# Altium project MiniCNC_ver2.PrjPcb
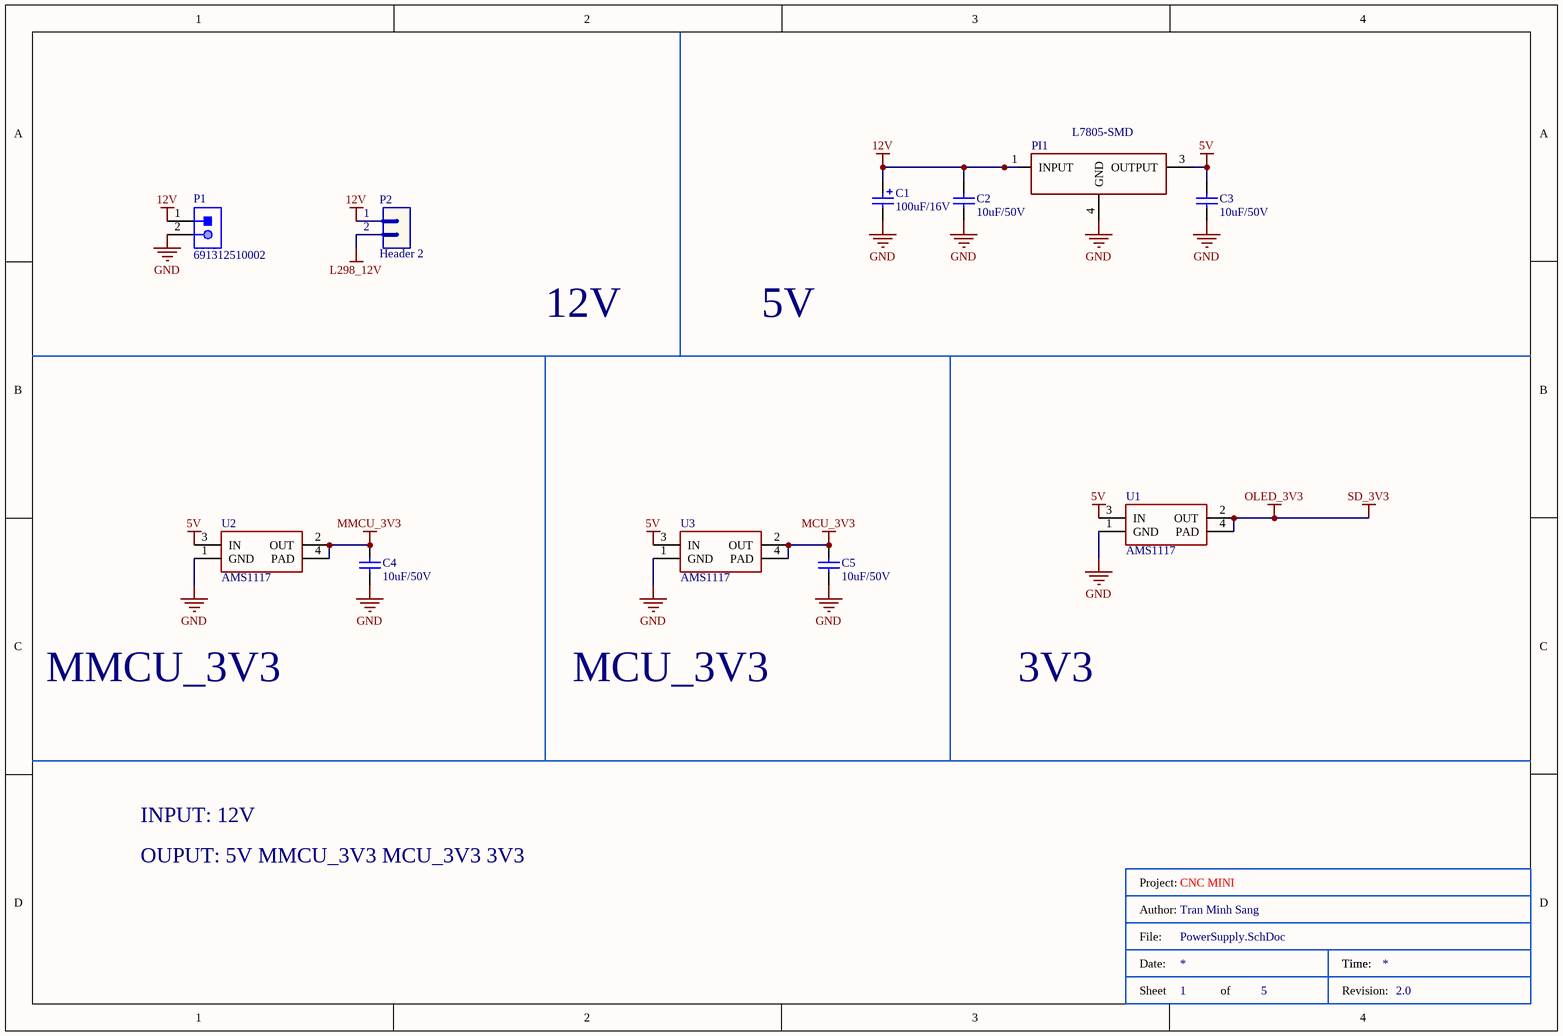
[diagram p0: PowerSupply.SchDoc]
MyAuthor: Tran Minh Sang; MyRevision: 2.0; Project: CNC MINI
5 sheets, 121 parts. Net scope: flat (ports and power ports of the same name join across sheets).
Board file: MiniCNC_ver2.PcbDoc
Sheets:
  PowerSupply.SchDoc
  MCU_Main.SchDoc
  MCU_Control.SchDoc
  Control_Display_SD.SchDoc
  Motor.SchDoc

## Sheet PowerSupply.SchDoc
size A4; SheetNumber: 1; SheetTotal: 5

### Parts
(Parts that share a designator on the sheet are numbered #1, #2 ... from top to bottom, then left to right.)
*#1  Title Block  (value not drawn)  (graphical)
C1  value 100uF/16V  [CAP-SM-AL-SIZE-D-D6L6]  (hidden comment: Cap-Al-100uF-16V-D6L5)
C2  value 10uF/50V  [CAP-SM-0805]  (hidden comment: Cap-10uF-50V-0805)
C3  value 10uF/50V  [CAP-SM-0805]  (hidden comment: Cap-10uF-50V-0805)
C4  value 10uF/50V  [CAP-SM-0805]  (hidden comment: Cap-10uF-50V-0805)
C5  value 10uF/50V  [CAP-SM-0805]  (hidden comment: Cap-10uF-50V-0805)
P1  691312510002  [691312510002]
P2  Header 2  [JP2]
PI1  L7805-SMD  [TO254P1435X464-4N]
U1  AMS1117  [SOT223]
U2  AMS1117  [SOT223]
U3  AMS1117  [SOT223]

### Nets
5V: C3.2 PI1.3(OUTPUT) U1.3(IN) U2.3(IN) U3.3(IN)
12V: C1.1 C2.2 P1.1 P2.1 PI1.1(INPUT)
GND: C1.2 C2.1 C3.1 C4.2 C5.2 P1.2 PI1.4(GND) U1.1(GND) U2.1(GND) U3.1(GND)
L298_12V: P2.2
MCU_3V3: C5.1 U3.2(OUT) U3.4(PAD)
MMCU_3V3: C4.1 U2.2(OUT) U2.4(PAD)
OLED_3V3: U1.2(OUT) U1.4(PAD)  [also labelled SD_3V3]  [project net VDD]

### Notes on the sheet
- 12V
- 5V
- MMCU_3V3
- MCU_3V3
- 3V3
- INPUT: 12V
- OUPUT: 5V MMCU_3V3 MCU_3V3 3V3
- (in symbol Title Block) Project:; Author:; File:; Date:; Time:; Sheet; of; Revision:

### Library data of the parts
C1 = Cap-Al-100uF-16V-D6L5: CAP ALUM 100UF 20% 16V SMD; Manufacturer: Nichicon; Manufacturer Part Number: UWX1C101MCL1GB; Local Supplier: thegioiic; Local Supplier Link: https://www.thegioiic.com/products/tu-nhom-smd-100uf-16v-6-3x5-4mm; Supplier 1: Digikey; Supplier 1 Part Number: 493-2105-1-ND; Supplier 1 Link: https://www.digikey.com/product-detail/en/nichicon/UWX1C101MCL1GB/493-2105-1-ND/590080
C2-C5 = Cap-10uF-50V-0805: CAP CER 10UF 50V X5R 0805; Manufacturer: Yageo; Manufacturer Part Number: CC0805KKX5R9BB106; Local Supplier: thegioiic; Local Supplier Link: https://www.thegioiic.com/products/tu-gom-0805-10uf-50v; Supplier 1: Digikey; Supplier 1 Link: https://www.digikey.com/product-detail/en/yageo/CC0805KKX5R9BB106/311-3499-2-ND/7164383; Supplier 1 Part Number: 311-3499-2-ND
P1 = 691312510002: WR-TBL Serie 312 Open Horizontal PCB Header, Pluggable, pitch 5.08mm, 2p; Compliance: RoHS; Modularity: No; Pin Number: 2; Rated Current [UL]: 20A; Working Voltage [UL]: 300VAC; ComponentLink1Description: Manufacturer; ComponentLink1URL: http://www.we-online.de; ComponentLink2URL: https://katalog.we-online.de/em/datasheet/691312510002.pdf; ComponentLink2Description: Datasheet; Mounting Technology: THT; Part Number: 691312510002; Packaging: Box; Operating Temperature: -40 to +105degC; PCB/Cable/Panel: PCB; Pitch: 5.08mm; Published Date: October 2019; Type: Horizontal; Publisher: Wurth Elektronik; Application: Pluggable
P2 = Header 2: Header, 2-Pin; LatestRevisionDate: 17-Jul-2002; LatestRevisionNote: Re-released for DXP Platform.; Publisher: Altium Limited; Local Supplier: thegioiic; Local Supplier Part Number: x; Local Supplier Link: https://www.thegioiic.com/products/hang-rao-duc-don-2-54mm-40-chan-1-hang-cao-11-4mm-xuyen-lo
U1-U3 = AMS1117: Available in 1.8V, 2.5V, 2.85V, 3.3V, 5V, and  Adjustable Versions; Local Supplier: thegioiic; Local Supplier Part Number: *; Local Supplier Link: https://www.thegioiic.com/products/ams1117-3-3v
PI1 = L7805-SMD: Local Supplier: thegioiic; Local Supplier Part Number: *; Local Supplier Link: https://www.thegioiic.com/products/l7805acd2t

## Sheet MCU_Main.SchDoc
size A4; SheetNumber: 2; SheetTotal: 5
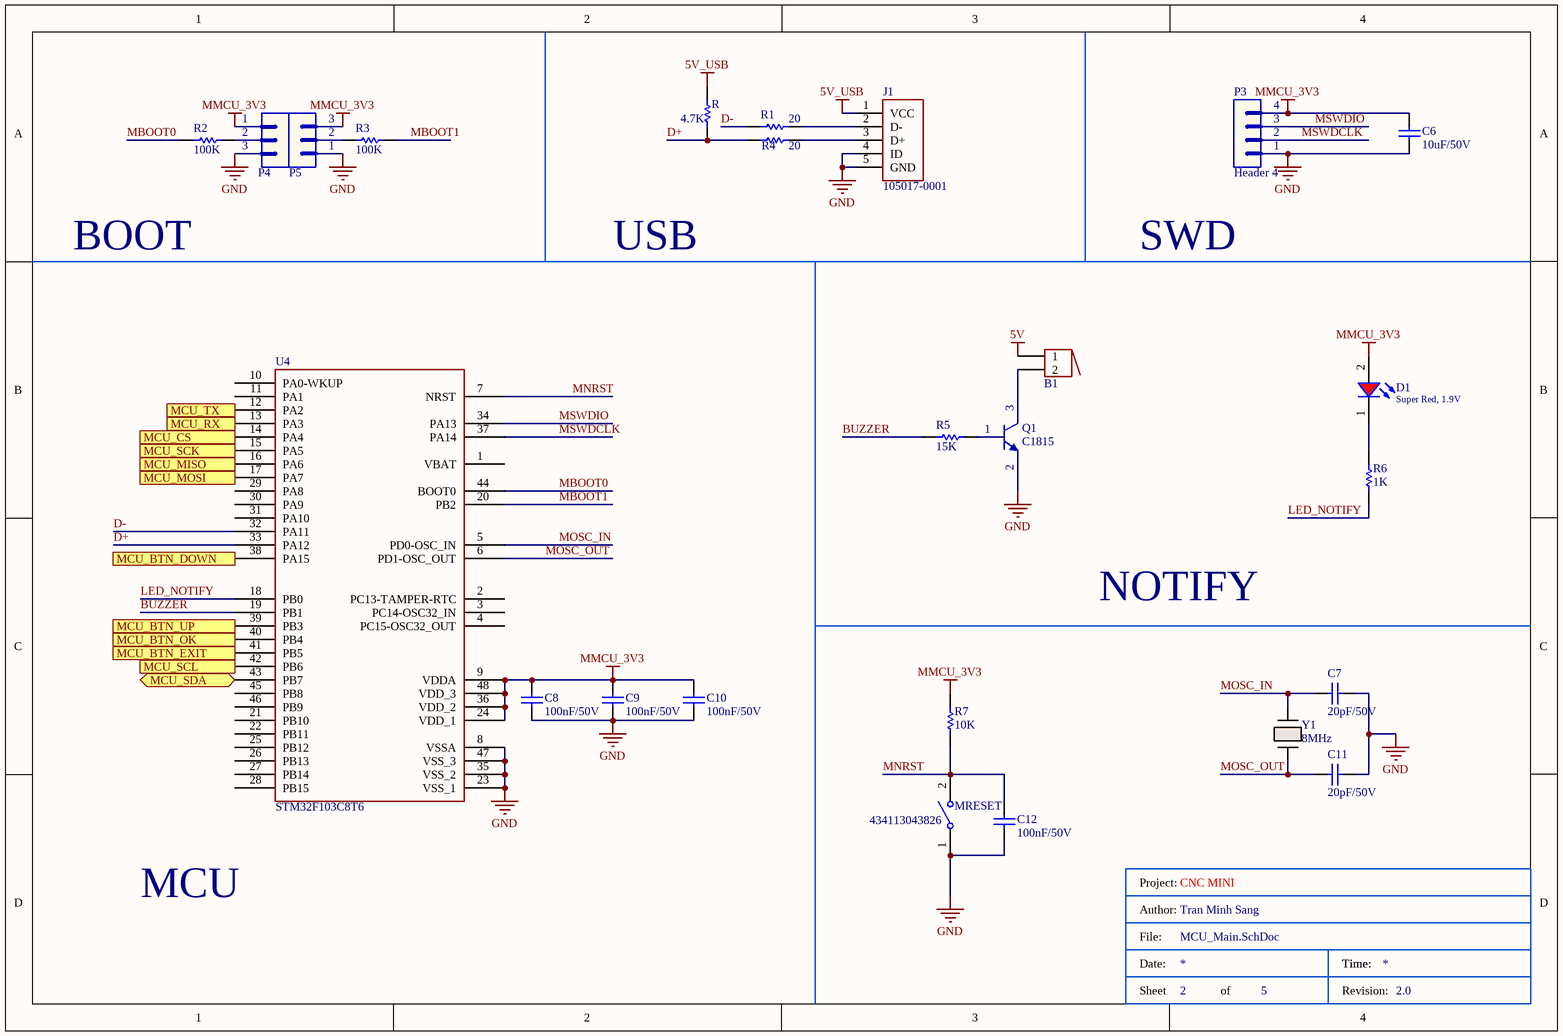
[diagram p1: MCU_Main.SchDoc]

### Parts
(Parts that share a designator on the sheet are numbered #1, #2 ... from top to bottom, then left to right.)
*#2  Title Block  (value not drawn)  (graphical)
B1  Buzzer  [BUZZER]  (value not drawn)
C6  value 10uF/50V  [CAP-SM-0805]  (hidden comment: Cap-10uF-50V-0805)
C7  value 20pF/50V  [CAP-SM-0805]  (hidden comment: Cap-22pF-50V-0805)
C8  value 100nF/50V  [CAP-SM-0805]  (hidden comment: Cap-100nF-50V-0805)
C9  value 100nF/50V  [CAP-SM-0805]  (hidden comment: Cap-100nF-50V-0805)
C10  value 100nF/50V  [CAP-SM-0805]  (hidden comment: Cap-100nF-50V-0805)
C11  value 20pF/50V  [CAP-SM-0805]  (hidden comment: Cap-22pF-50V-0805)
C12  value 100nF/50V  [CAP-SM-0805]  (hidden comment: Cap-100nF-50V-0805)
D1  Super Red, 1.9V  [WL-SMCW_0805]
J1  105017-0001  [Micro-USB-Female]
MRESET  434113043826  [434113043826]
P3  Header 4  [JP4]
P4  Header 3  [JP3]  (value not drawn)
P5  Header 3  [JP3]  (value not drawn)
Q1  C1815  [SOT23_NEX]
R  value 4.7K  [RES-SM-0805]  (hidden comment: Res-4.7K-0805)
R1  value 20  [RES-SM-0805]  (hidden comment: Res-270-0805)
R2  value 100K  [RES-SM-0805]  (hidden comment: Res-100K-0805)
R3  value 100K  [RES-SM-0805]  (hidden comment: Res-100K-0805)
R4  value 20  [RES-SM-0805]  (hidden comment: Res-270-0805)
R5  value 15K  [RES-SM-0805]  (hidden comment: Res-15K-0805)
R6  value 1K  [RES-SM-0805]  (hidden comment: Res-1K-0805)
R7  value 10K  [RES-SM-0805]  (hidden comment: Res-10k-0805)
U4  STM32F103C8T6  [LQFP-48]
Y1  8MHz  [xtal2_CX5032GB_AVX-L]

### Ports
MCU_BTN_DOWN (out), MCU_BTN_EXIT (out), MCU_BTN_OK (out), MCU_BTN_UP (out), MCU_CS (out), MCU_MISO (in), MCU_MOSI (out), MCU_RX (in), MCU_SCK (out), MCU_SCL (out), MCU_SDA (bidir), MCU_TX (out)

### Nets
5V: B1.1
5V_USB: J1.1(VCC) R.1
GND: C6.1 C7.1 C8.2 C9.2 C10.2 C11.1 C12.1 J1.4(ID) J1.5(GND) MRESET.1 P3.1 P4.3 P5.1 Q1.2(E) U4.8(VSSA) U4.23(VSS_1) U4.35(VSS_2) U4.47(VSS_3)
MMCU_3V3: C6.2 C8.1 C9.1 C10.1 D1.2(A) P3.4 P4.1 P5.3 R7.2 U4.9(VDDA) U4.24(VDD_1) U4.36(VDD_2) U4.48(VDD_3)
BUZZER: R5.1 U4.19(PB1)
CMD: U4.17(PA7) ; port MCU_MOSI
CS: U4.14(PA4) ; port MCU_CS
D+: R.2 R4.2 U4.33(PA12)
D-: R1.2 U4.32(PA11)
DAT0: U4.16(PA6) ; port MCU_MISO
LED_NOTIFY: R6.1 U4.18(PB0)
MBOOT0: R2.1 U4.44(BOOT0)
MBOOT1: R3.2 U4.20(PB2)
MNRST: C12.2 MRESET.2 R7.1 U4.7(NRST)
MOSC_IN: C7.2 U4.5(PD0-OSC_IN) Y1.1
MOSC_OUT: C11.2 U4.6(PD1-OSC_OUT) Y1.2
MSWDCLK: P3.2 U4.37(PA14)
MSWDIO: P3.3 U4.34(PA13)
NetB1_2: B1.2 Q1.3(C)
NetC25_2: U4.39(PB3) ; port MCU_BTN_UP
NetC26_2: U4.38(PA15) ; port MCU_BTN_DOWN
NetC27_2: U4.40(PB4) ; port MCU_BTN_OK
NetC28_2: U4.41(PB5) ; port MCU_BTN_EXIT
NetD1_1: D1.1(K) R6.2
NetJ1_2: J1.2(D-) R1.1
NetJ1_3: J1.3(D+) R4.1
NetP4_2: P4.2 R2.2
NetP5_2: P5.2 R3.1
NetQ1_1: Q1.1(B) R5.2
NetU4_12: U4.12(PA2) ; port MCU_TX
NetU4_13: U4.13(PA3) ; port MCU_RX
NetU4_15: U4.15(PA5) ; port MCU_SCK
NetU4_42: U4.42(PB6) ; port MCU_SCL
NetU4_43: U4.43(PB7) ; port MCU_SDA

Not connected (* = marked no-connect by the designer): U4 1(VBAT) 2(PC13-TAMPER-RTC) 3(PC14-OSC32_IN) 4(PC15-OSC32_OUT) 10(PA0-WKUP) 11(PA1) 21(PB10) 22(PB11) 25(PB12) 26(PB13) 27(PB14) 28(PB15) 29(PA8) 30(PA9) 31(PA10) 45(PB8) 46(PB9)

### Notes on the sheet
- BOOT
- USB
- SWD
- NOTIFY
- MCU
- (in symbol Title Block) Project:; Author:; File:; Date:; Time:; Sheet; of; Revision:

### Library data of the parts
C6 = Cap-10uF-50V-0805: as C2 on sheet PowerSupply; Local Supplier: thegioiic; Local Supplier Link: https://www.thegioiic.com/products/tu-gom-0805-10uf-50v; Supplier 1: Digikey; Supplier 1 Link: https://www.digikey.com/product-detail/en/yageo/CC0805KKX5R9BB106/311-3499-2-ND/7164383; Supplier 1 Part Number: 311-3499-2-ND
C7 C11 = Cap-22pF-50V-0805: CAP CER 22PF 100V X7R 0805; Manufacturer: Johanson Dielectrics Inc.; Manufacturer Part Number: 101X15W102MV4E; Local Supplier: thegioiic; Local Supplier Link: https://thegioiic.com/products/tu-1nf-50v-0805; Supplier 1: Digikey; Supplier 1 Link: https://www.digikey.com/product-detail/en/johanson-dielectrics-inc/101X15W102MV4E/709-1335-1-ND/2327235; Supplier 1 Part Number: 709-1335-1-ND
C8-C10 C12 = Cap-100nF-50V-0805: CAP CER 0.1UF 50V Y5V 0805; Manufacturer: Samsung Electro-Mechanics; Manufacturer Part Number: CL21F104ZBCNNNC; Local Supplier: thegioiic; Local Supplier Link: https://www.thegioiic.com/products/tu-gom-0805-100nf-0-1uf-50v; Supplier 1: Digikey; Supplier 1 Part Number: 1276-1007-1-ND; Supplier 1 Link: https://www.digikey.com/product-detail/en/samsung-electro-mechanics/CL21F104ZBCNNNC/1276-1007-1-ND/3889093
D1 = 150080SS75000: WL-SMCW SMT Mono-color Chip LED Waterclear, size 0805, Super Red, 1.9V, 140deg; Chip Technology: AlInGaP; Dominant Wavelength typ.: 630nm; Luminous Intensity typ.: 60mcd; Peak Wavelength typ.: 645nm; Viewing Angle: 140deg; ComponentLink1Description: Manufacturer; ComponentLink1URL: http://www.we-online.de; ComponentLink2URL: https://www.we-online.com/catalog/datasheet/150080SS75000.pdf; ComponentLink2Description: Datasheet; Forward Voltage typ.: 1.9V; Emitting Color: Super Red; Mounting Technology: SMT; Operating Temperature: -40 to +85degC; Published Date: December 2019; Part Number: 150080SS75000; Packaging: Tape and Reel; Size: 0805; Publisher: Wurth Elektronik
J1 = Micro-USB-Female: CONN RCPT USB2.0 MICRO B SMD R/A; Vendor: Molex Connector Corporation; Built_By: EMA_Cory; SourceLibrary: Molex_2020-05-26; Datasheet: https://www.molex.com/pdm_docs/sd/1050170001_sd.pdf; Manufacturer_Part_Number: 105017-0001; Copyright: Copyright (C) 2018 Accelerated Designs. All rights reserved; RefDes: RefDes; Type: DEV; Local Supplier: thegioiic; Local Supplier Part Number: x; Local Supplier Link: https://www.thegioiic.com/products/cong-usb-micro-b-2-0-dau-cai-5-chan-smd-v1
MRESET = 434113043826: WS-TASV J-Bend SMT Tact Switch 6x3.5mm, height 4.3mm, 260gf; Rated Voltage: 12VDC; Rated Current: 50mA; Washable: No; ComponentLink1Description: Manufacturer; ComponentLink1URL: http://www.we-online.de; ComponentLink2Description: Datasheet; ComponentLink2URL: https://katalog.we-online.com/em/datasheet/434113043826.pdf; Operating Temperature: -40 to +85degC; Part Number: 434113043826; Published Date: September 2019; Contact Material: Stainless Steel; Height: 4.3mm; Mounting Technology: SMT; Contact Plating: Silver; Operation Force: 260gf; Packaging: Tape and Reel; Terminal Material: Copper Alloy; Publisher: Wurth Elektronik; Terminal Plating: Silver; Local Supplier: thegioiic; Local Supplier Link: https://www.thegioiic.com/products/nut-nhan-3-5x6mm-cao-5mm-2-chan-smd-dau-trang; Local Supplier Part Number: x
P3 = Header 4: Header, 4-Pin; LatestRevisionDate: 17-Jul-2002; LatestRevisionNote: Re-released for DXP Platform.; Publisher: Altium Limited; Local Supplier: thegioiic; Local Supplier Part Number: x; Local Supplier Link: https://www.thegioiic.com/products/hang-rao-duc-don-2-54mm-40-chan-1-hang-cao-11-4mm-xuyen-lo
P4 P5 = Header 3: Header, 3-Pin; LatestRevisionDate: 17-Jul-2002; LatestRevisionNote: Re-released for DXP Platform.; Publisher: Altium Limited; Local Supplier: thegioiic; Local Supplier Part Number: x; Local Supplier Link: https://www.thegioiic.com/products/hang-rao-duc-don-2-54mm-40-chan-1-hang-cao-11-4mm-xuyen-lo
R = Res-4.7K-0805: RES SMD 4.7K OHM 5% 1/8W 0805; Manufacturer: Yageo; Manufacturer Part Number: RC0805JR-074K7L; Local Supplier: thegioiic; Local Supplier Link: https://www.thegioiic.com/products/dien-tro-4-7-kohm-0805-5; Supplier 1: Digikey; Supplier 1 Link: https://www.digikey.com/product-detail/en/yageo/RC0805JR-074K7L/311-4.7KARCT-ND/731274; Supplier 1 Part Number: 311-4.7KARCT-ND
R1 R4 = Res-270-0805: RES SMD 270 OHM 0.1% 0.15W 0705; Manufacturer: Vishay Dale; Manufacturer Part Number: M55342E06B270ART5; Local Supplier: thegioiic; Local Supplier Link: https://thegioiic.com/products/dien-tro-270-ohm-0805-5; Supplier 1: Digikey; Supplier 1 Link: https://www.digikey.com/product-detail/en/vishay-dale/M55342E06B270ART5/1135-1723-6-ND/3197905; Supplier 1 Part Number: 1135-1723-6-ND
R2 R3 = Res-100K-0805: RES 0 OHM JUMPER 0805; Manufacturer: Vishay Dale; Manufacturer Part Number: WSL080500000ZEA9; Local Supplier: thegioiic; Local Supplier Link: https://www.thegioiic.com/products/dien-tro-100-kohm-0805-5; Supplier 1: Digikey; Supplier 1 Link: https://www.digikey.com/product-detail/en/vishay-dale/WSL080500000ZEA9/541-3928-1-ND/7423223; Supplier 1 Part Number: 541-3928-1-ND
R5 = Res-15K-0805: RES 15K OHM 1% 1/4W 0805; Manufacturer: TE Connectivity Passive Product; Manufacturer Part Number: CRGCQ0805F15K; Local Supplier: thegioiic; Local Supplier Link: https://www.thegioiic.com/products/dien-tro-15-kohm-0805-5; Supplier 1: Digikey; Supplier 1 Part Number: A129763CT-ND; Supplier 1 Link: https://www.digikey.com/product-detail/en/te-connectivity-passive-product/CRGCQ0805F15K/A129763CT-ND/8577595
R6 = Res-1K-0805: RES 1K OHM 1% 1/4W 0805; Manufacturer: Stackpole Electronics Inc; Manufacturer Part Number: RNCP0805FTD1K00; Local Supplier: thegioiic; Local Supplier Link: https://www.thegioiic.com/products/dien-tro-1-kohm-0805-5; Supplier 1: Digikey; Supplier 1 Link: https://www.digikey.com/product-detail/en/stackpole-electronics-inc/RNCP0805FTD1K00/RNCP0805FTD1K00CT-ND/2240568; Supplier 1 Part Number: RNCP0805FTD1K00CT-ND
R7 = Res-10k-0805: RES 10K OHM 1% 1/4W 0805; Manufacturer: Stackpole Electronics Inc; Manufacturer Part Number: RNCP0805FTD10K0; Local Supplier: thegioiic; Local Supplier Link: https://www.thegioiic.com/products/dien-tro-10-kohm-0805-5; Supplier 1: Digikey; Supplier 1 Link: https://www.digikey.com/product-detail/en/stackpole-electronics-inc/RNCP0805FTD10K0/RNCP0805FTD10K0CT-ND/2240601; Supplier 1 Part Number: RNCP0805FTD10K0CT-ND
U4 = STM32F103C8T6: Manufacturer: ST Electronic; Manufacture Part Number: STM32F103C8T6; Local Supplier: thegioiic; Local Supplier Part Number: STM32F103C8T6; Local Supplier Link: https://www.thegioiic.com/products/stm32f103c8t6
Y1 = XTAL: No Description Available; Mfr_Name: KYOCERA AVX; Manufacturer_Part_Number: CX5032GB08000H0HEQZ1; Copyright: Copyright (C) 2023 Ultra Librarian. All rights reserved.; RefDes: RefDes; Type: DEV
B1 = Buzzer: Local Supplier: thegioiic; Local Supplier Link: https://www.thegioiic.com/products/1209-dip-buzzer-12x9mm; Local Supplier Part Number: 1209 DIP Buzzer 12x9mm

## Sheet MCU_Control.SchDoc
size A4; SheetNumber: 3; SheetTotal: 5
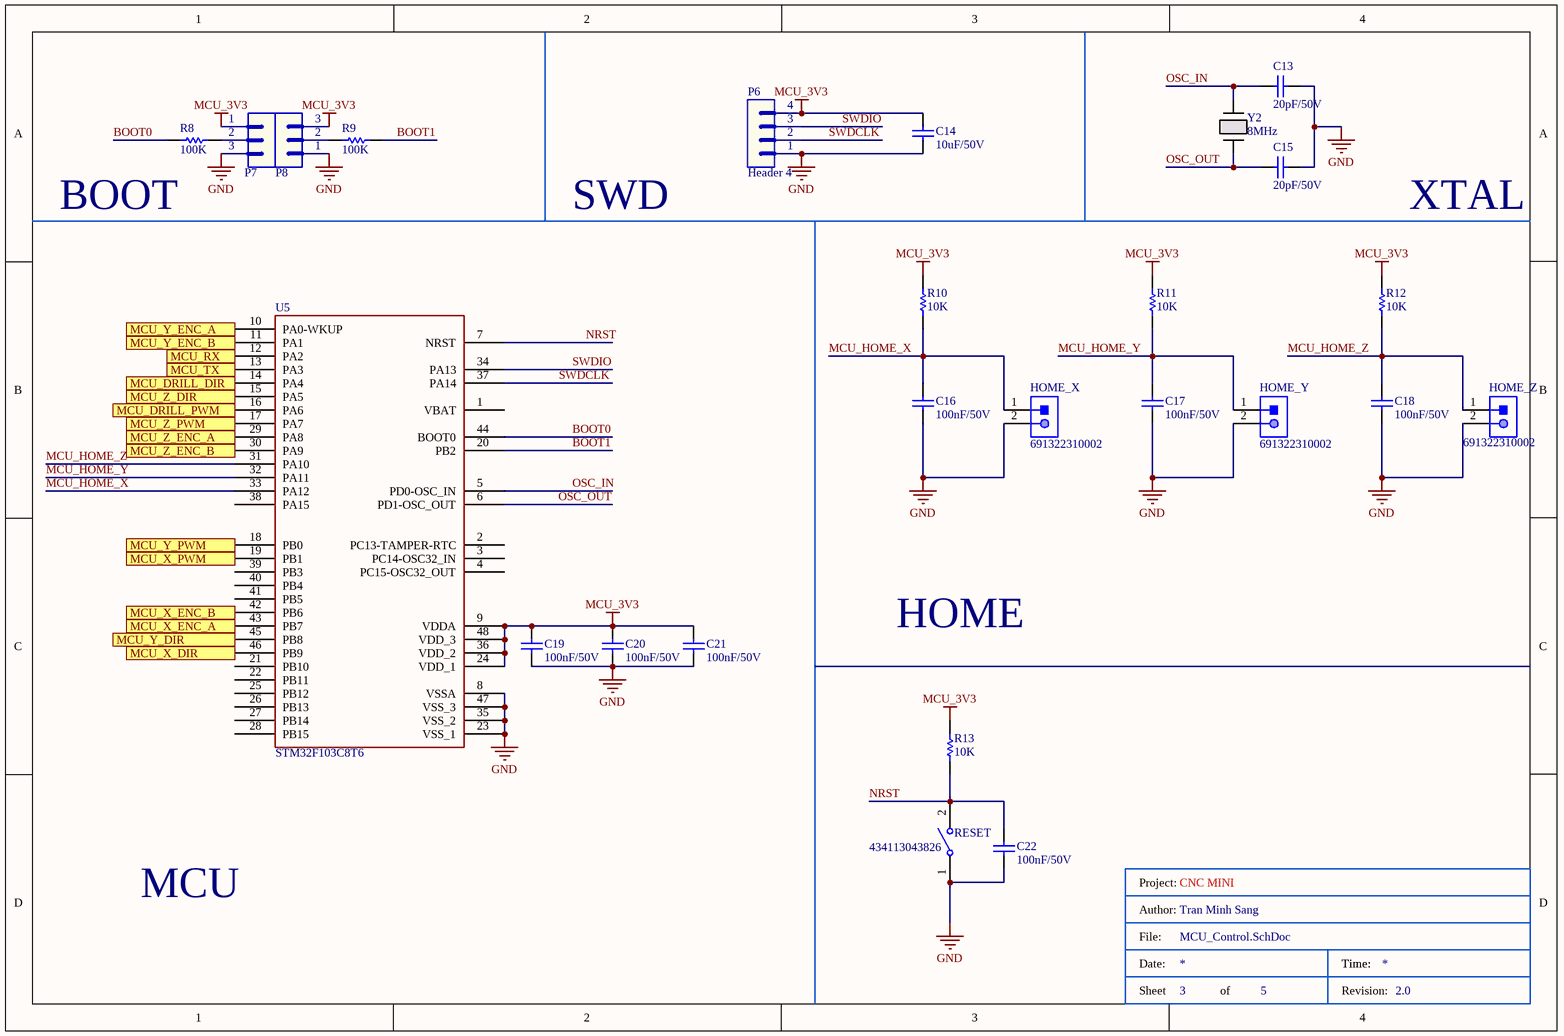
[diagram p2: MCU_Control.SchDoc]

### Parts
(Parts that share a designator on the sheet are numbered #1, #2 ... from top to bottom, then left to right.)
*#3  Title Block  (value not drawn)  (graphical)
C13  value 20pF/50V  [CAP-SM-0805]  (hidden comment: Cap-22pF-50V-0805)
C14  value 10uF/50V  [CAP-SM-0805]  (hidden comment: Cap-10uF-50V-0805)
C15  value 20pF/50V  [CAP-SM-0805]  (hidden comment: Cap-22pF-50V-0805)
C16  value 100nF/50V  [CAP-SM-0805]  (hidden comment: Cap-100nF-50V-0805)
C17  value 100nF/50V  [CAP-SM-0805]  (hidden comment: Cap-100nF-50V-0805)
C18  value 100nF/50V  [CAP-SM-0805]  (hidden comment: Cap-100nF-50V-0805)
C19  value 100nF/50V  [CAP-SM-0805]  (hidden comment: Cap-100nF-50V-0805)
C20  value 100nF/50V  [CAP-SM-0805]  (hidden comment: Cap-100nF-50V-0805)
C21  value 100nF/50V  [CAP-SM-0805]  (hidden comment: Cap-100nF-50V-0805)
C22  value 100nF/50V  [CAP-SM-0805]  (hidden comment: Cap-100nF-50V-0805)
HOME_X  691322310002  [691322310002]
HOME_Y  691322310002  [691322310002]
HOME_Z  691322310002  [691322310002]
P6  Header 4  [JP4]
P7  Header 3  [JP3]  (value not drawn)
P8  Header 3  [JP3]  (value not drawn)
R8  value 100K  [RES-SM-0805]  (hidden comment: Res-100K-0805)
R9  value 100K  [RES-SM-0805]  (hidden comment: Res-100K-0805)
R10  value 10K  [RES-SM-0805]  (hidden comment: Res-10k-0805)
R11  value 10K  [RES-SM-0805]  (hidden comment: Res-10k-0805)
R12  value 10K  [RES-SM-0805]  (hidden comment: Res-10k-0805)
R13  value 10K  [RES-SM-0805]  (hidden comment: Res-10k-0805)
RESET  434113043826  [434113043826]
U5  STM32F103C8T6  [LQFP-48]
Y2  8MHz  [xtal2_CX5032GB_AVX-L]

### Ports
MCU_DRILL_DIR (out), MCU_DRILL_PWM (out), MCU_RX (out), MCU_TX (in), MCU_X_DIR (out), MCU_X_ENC_A (in), MCU_X_ENC_B (in), MCU_X_PWM (out), MCU_Y_DIR (out), MCU_Y_ENC_A (in), MCU_Y_ENC_B (in), MCU_Y_PWM (out), MCU_Z_DIR (out), MCU_Z_ENC_A (in), MCU_Z_ENC_B (in), MCU_Z_PWM (out)

### Nets
GND: C13.1 C14.1 C15.1 C16.1 C17.1 C18.1 C19.2 C20.2 C21.2 C22.1 HOME_X.2 HOME_Y.2 HOME_Z.2 P6.1 P7.3 P8.1 RESET.1 U5.8(VSSA) U5.23(VSS_1) U5.35(VSS_2) U5.47(VSS_3)
MCU_3V3: C14.2 C19.1 C20.1 C21.1 P6.4 P7.1 P8.3 R10.2 R11.2 R12.2 R13.2 U5.9(VDDA) U5.24(VDD_1) U5.36(VDD_2) U5.48(VDD_3)
BOOT0: R8.1 U5.44(BOOT0)
BOOT1: R9.2 U5.20(PB2)
MCU_HOME_X: C16.2 HOME_X.1 R10.1 U5.33(PA12)
MCU_HOME_Y: C17.2 HOME_Y.1 R11.1 U5.32(PA11)
MCU_HOME_Z: C18.2 HOME_Z.1 R12.1 U5.31(PA10)
NRST: C22.2 R13.1 RESET.2 U5.7(NRST)
OSC_IN: C13.2 U5.5(PD0-OSC_IN) Y2.1
OSC_OUT: C15.2 U5.6(PD1-OSC_OUT) Y2.2
SWDCLK: P6.2 U5.37(PA14)
SWDIO: P6.3 U5.34(PA13)
NetP7_2: P7.2 R8.2
NetP8_2: P8.2 R9.1
NetU4_12: U5.13(PA3) ; port MCU_TX
NetU4_13: U5.12(PA2) ; port MCU_RX
NetU5_10: U5.10(PA0-WKUP) ; port MCU_Y_ENC_A
NetU5_11: U5.11(PA1) ; port MCU_Y_ENC_B
NetU5_14: U5.14(PA4) ; port MCU_DRILL_DIR
NetU5_15: U5.15(PA5) ; port MCU_Z_DIR
NetU5_16: U5.16(PA6) ; port MCU_DRILL_PWM
NetU5_17: U5.17(PA7) ; port MCU_Z_PWM
NetU5_18: U5.18(PB0) ; port MCU_Y_PWM
NetU5_19: U5.19(PB1) ; port MCU_X_PWM
NetU5_29: U5.29(PA8) ; port MCU_Z_ENC_A
NetU5_30: U5.30(PA9) ; port MCU_Z_ENC_B
NetU5_42: U5.42(PB6) ; port MCU_X_ENC_B
NetU5_43: U5.43(PB7) ; port MCU_X_ENC_A
NetU5_45: U5.45(PB8) ; port MCU_Y_DIR
NetU5_46: U5.46(PB9) ; port MCU_X_DIR

Not connected (* = marked no-connect by the designer): U5 1(VBAT) 2(PC13-TAMPER-RTC) 3(PC14-OSC32_IN) 4(PC15-OSC32_OUT) 21(PB10) 22(PB11) 25(PB12) 26(PB13) 27(PB14) 28(PB15) 38(PA15) 39(PB3) 40(PB4) 41(PB5)

### Notes on the sheet
- (near R8) BOOT
- SWD
- XTAL
- HOME
- MCU
- (in symbol Title Block) Project:; Author:; File:; Date:; Time:; Sheet; of; Revision:

### Library data of the parts
C13 C15 = Cap-22pF-50V-0805: as C7 on sheet MCU_Main; Local Supplier: thegioiic; Local Supplier Link: https://thegioiic.com/products/tu-1nf-50v-0805; Supplier 1: Digikey; Supplier 1 Link: https://www.digikey.com/product-detail/en/johanson-dielectrics-inc/101X15W102MV4E/709-1335-1-ND/2327235; Supplier 1 Part Number: 709-1335-1-ND
C14 = Cap-10uF-50V-0805: as C2 on sheet PowerSupply; Local Supplier: thegioiic; Local Supplier Link: https://www.thegioiic.com/products/tu-gom-0805-10uf-50v; Supplier 1: Digikey; Supplier 1 Link: https://www.digikey.com/product-detail/en/yageo/CC0805KKX5R9BB106/311-3499-2-ND/7164383; Supplier 1 Part Number: 311-3499-2-ND
C16-C22 = Cap-100nF-50V-0805: as C8 on sheet MCU_Main; Local Supplier: thegioiic; Local Supplier Link: https://www.thegioiic.com/products/tu-gom-0805-100nf-0-1uf-50v; Supplier 1: Digikey; Supplier 1 Part Number: 1276-1007-1-ND; Supplier 1 Link: https://www.digikey.com/product-detail/en/samsung-electro-mechanics/CL21F104ZBCNNNC/1276-1007-1-ND/3889093
HOME_X HOME_Y HOME_Z = 691322310002: WR-TBL Serie 322 Horizontal PCB Header, Pluggable, pitch 3.81mm, 2p; Compliance: RoHS; Modularity: No; Pin Number: 2; Rated Current [UL]: 10A; Working Voltage [UL]: 300VAC; ComponentLink1Description: Manufacturer; ComponentLink1URL: http://www.we-online.de; ComponentLink2URL: https://katalog.we-online.de/em/datasheet/691322310002.pdf; ComponentLink2Description: Datasheet; Mounting Technology: THT; Part Number: 691322310002; Packaging: Box; Operating Temperature: -40 to +105degC; PCB/Cable/Panel: PCB; Pitch: 3.81mm; Published Date: October 2019; Type: Horizontal; Publisher: Wurth Elektronik; Application: Pluggable
P6 = Header 4: Header, 4-Pin; LatestRevisionDate: 17-Jul-2002; LatestRevisionNote: Re-released for DXP Platform.; Publisher: Altium Limited; Local Supplier: thegioiic; Local Supplier Part Number: x; Local Supplier Link: https://www.thegioiic.com/products/hang-rao-duc-don-2-54mm-40-chan-1-hang-cao-11-4mm-xuyen-lo
P7 P8 = Header 3: Header, 3-Pin; LatestRevisionDate: 17-Jul-2002; LatestRevisionNote: Re-released for DXP Platform.; Publisher: Altium Limited; Local Supplier: thegioiic; Local Supplier Part Number: x; Local Supplier Link: https://www.thegioiic.com/products/hang-rao-duc-don-2-54mm-40-chan-1-hang-cao-11-4mm-xuyen-lo
R8 R9 = Res-100K-0805: as R2 on sheet MCU_Main; Local Supplier: thegioiic; Local Supplier Link: https://www.thegioiic.com/products/dien-tro-100-kohm-0805-5; Supplier 1: Digikey; Supplier 1 Link: https://www.digikey.com/product-detail/en/vishay-dale/WSL080500000ZEA9/541-3928-1-ND/7423223; Supplier 1 Part Number: 541-3928-1-ND
R10-R13 = Res-10k-0805: as R7 on sheet MCU_Main; Local Supplier: thegioiic; Local Supplier Link: https://www.thegioiic.com/products/dien-tro-10-kohm-0805-5; Supplier 1: Digikey; Supplier 1 Link: https://www.digikey.com/product-detail/en/stackpole-electronics-inc/RNCP0805FTD10K0/RNCP0805FTD10K0CT-ND/2240601; Supplier 1 Part Number: RNCP0805FTD10K0CT-ND
RESET = 434113043826: as MRESET on sheet MCU_Main; ComponentLink1Description: Manufacturer; ComponentLink1URL: http://www.we-online.de; ComponentLink2Description: Datasheet; ComponentLink2URL: https://katalog.we-online.com/em/datasheet/434113043826.pdf; Operating Temperature: -40 to +85degC; Part Number: 434113043826; Published Date: September 2019; Contact Material: Stainless Steel; Height: 4.3mm; Mounting Technology: SMT; Contact Plating: Silver; Operation Force: 260gf; Packaging: Tape and Reel; Terminal Material: Copper Alloy; Publisher: Wurth Elektronik; Terminal Plating: Silver; Local Supplier: thegioiic; Local Supplier Link: https://www.thegioiic.com/products/nut-nhan-3-5x6mm-cao-5mm-2-chan-smd-dau-trang; Local Supplier Part Number: x
U5 = STM32F103C8T6: Manufacturer: ST Electronic; Manufacture Part Number: STM32F103C8T6; Local Supplier: thegioiic; Local Supplier Part Number: STM32F103C8T6; Local Supplier Link: https://www.thegioiic.com/products/stm32f103c8t6
Y2 = XTAL: as Y1 on sheet MCU_Main; Copyright: Copyright (C) 2023 Ultra Librarian. All rights reserved.; RefDes: RefDes; Type: DEV

## Sheet Control_Display_SD.SchDoc
size A4; SheetNumber: 4; SheetTotal: 5
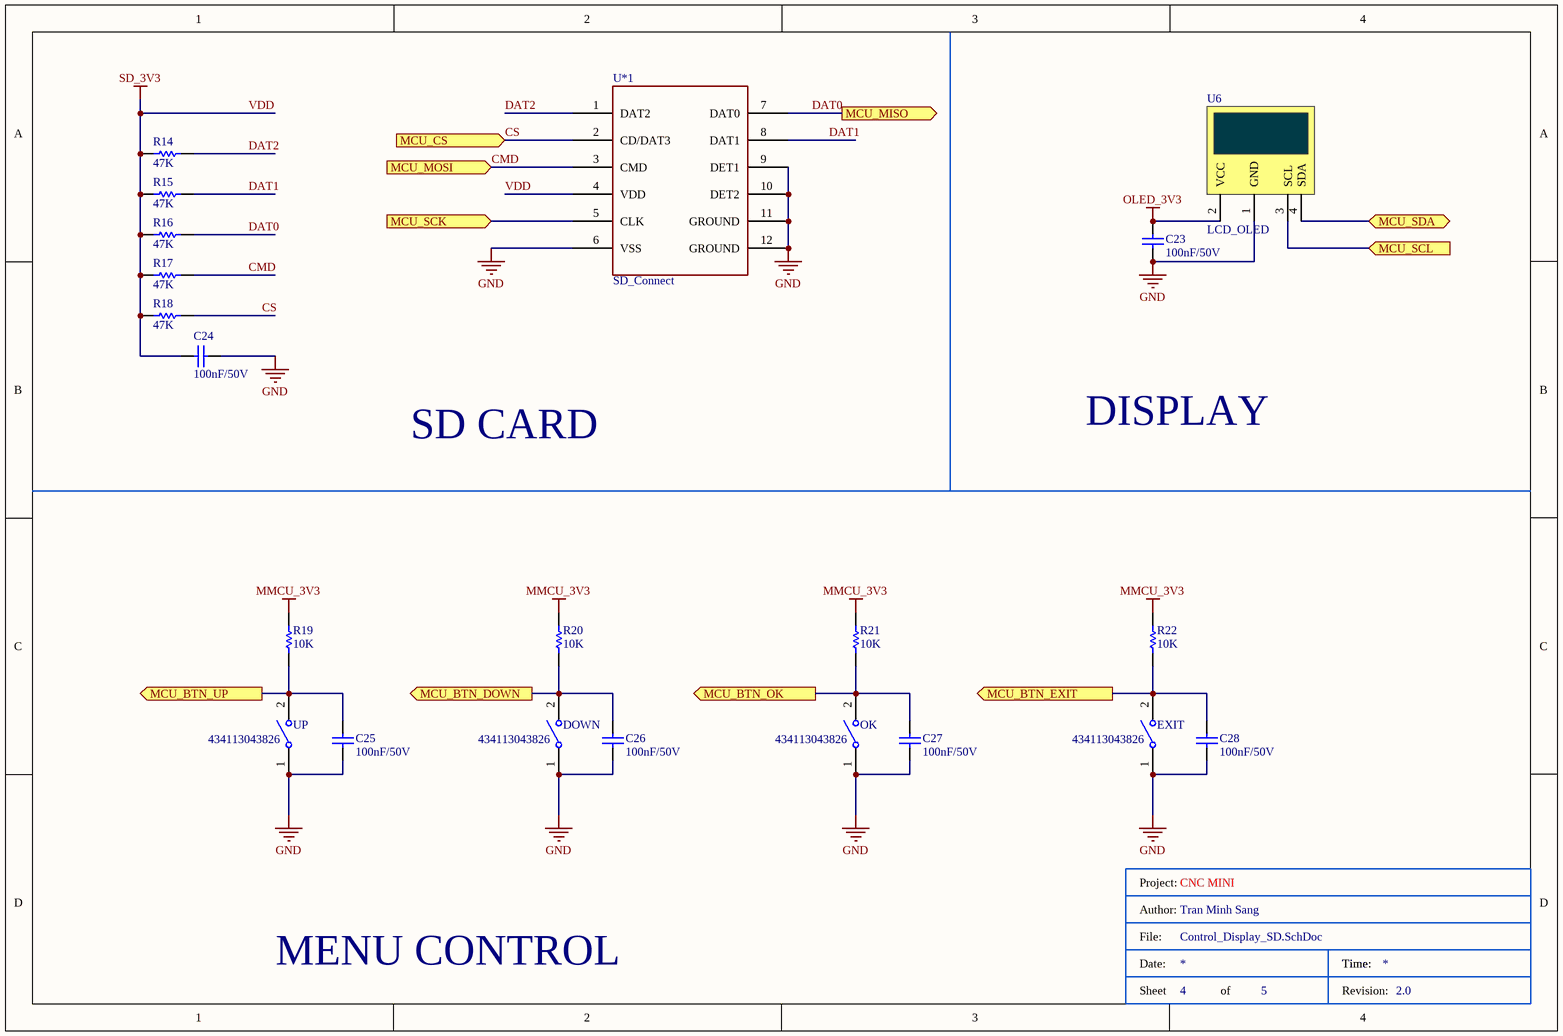
[diagram p3: Control_Display_SD.SchDoc]

### Parts
(Parts that share a designator on the sheet are numbered #1, #2 ... from top to bottom, then left to right.)
*#4  Title Block  (value not drawn)  (graphical)
C23  value 100nF/50V  [CAP-SM-0805]  (hidden comment: Cap-100nF-50V-0805)
C24  value 100nF/50V  [CAP-SM-0805]  (hidden comment: Cap-100nF-50V-0805)
C25  value 100nF/50V  [CAP-SM-0805]  (hidden comment: Cap-100nF-50V-0805)
C26  value 100nF/50V  [CAP-SM-0805]  (hidden comment: Cap-100nF-50V-0805)
C27  value 100nF/50V  [CAP-SM-0805]  (hidden comment: Cap-100nF-50V-0805)
C28  value 100nF/50V  [CAP-SM-0805]  (hidden comment: Cap-100nF-50V-0805)
DOWN  434113043826  [434113043826]
EXIT  434113043826  [434113043826]
OK  434113043826  [434113043826]
R14  value 47K  [RES-SM-0805]  (hidden comment: Res-47K-0805)
R15  value 47K  [RES-SM-0805]  (hidden comment: Res-47K-0805)
R16  value 47K  [RES-SM-0805]  (hidden comment: Res-47K-0805)
R17  value 47K  [RES-SM-0805]  (hidden comment: Res-47K-0805)
R18  value 47K  [RES-SM-0805]  (hidden comment: Res-47K-0805)
R19  value 10K  [RES-SM-0805]  (hidden comment: Res-10k-0805)
R20  value 10K  [RES-SM-0805]  (hidden comment: Res-10k-0805)
R21  value 10K  [RES-SM-0805]  (hidden comment: Res-10k-0805)
R22  value 10K  [RES-SM-0805]  (hidden comment: Res-10k-0805)
U6  LCD_OLED  [LCD_OLED]
U*1  SD_Connect  [SD_CONNECT]
UP  434113043826  [434113043826]

### Ports
MCU_BTN_DOWN (out), MCU_BTN_EXIT (out), MCU_BTN_OK (out), MCU_BTN_UP (out), MCU_CS (in), MCU_MISO (out), MCU_MOSI (in), MCU_SCK (in), MCU_SCL (in), MCU_SDA (bidir)

### Nets
GND: C23.1 C24.2 C25.1 C26.1 C27.1 C28.1 DOWN.1 EXIT.1 OK.1 U6.1(GND) U*1.6(VSS) U*1.9(DET1) U*1.10(DET2) U*1.11(GROUND) U*1.12(GROUND) UP.1
MMCU_3V3: R19.2 R20.2 R21.2 R22.2
VDD: C23.2 C24.1 R14.2 R15.2 R16.2 R17.2 R18.2 U6.2(VCC) U*1.4(VDD)  [also labelled OLED_3V3, SD_3V3]
CMD: R17.1 U*1.3(CMD) ; port MCU_MOSI
CS: R18.1 U*1.2(CD/DAT3) ; port MCU_CS
DAT0: R16.1 U*1.7(DAT0) ; port MCU_MISO
DAT1: R15.1 U*1.8(DAT1)
DAT2: R14.1 U*1.1(DAT2)
NetC25_2: C25.2 R19.1 UP.2 ; port MCU_BTN_UP
NetC26_2: C26.2 DOWN.2 R20.1 ; port MCU_BTN_DOWN
NetC27_2: C27.2 OK.2 R21.1 ; port MCU_BTN_OK
NetC28_2: C28.2 EXIT.2 R22.1 ; port MCU_BTN_EXIT
NetU4_15: U*1.5(CLK) ; port MCU_SCK
NetU4_42: U6.3(SCL) ; port MCU_SCL
NetU4_43: U6.4(SDA) ; port MCU_SDA

### Notes on the sheet
- SD CARD
- DISPLAY
- MENU CONTROL
- (in symbol Title Block) Project:; Author:; File:; Date:; Time:; Sheet; of; Revision:

### Library data of the parts
C23-C28 = Cap-100nF-50V-0805: as C8 on sheet MCU_Main; Local Supplier: thegioiic; Local Supplier Link: https://www.thegioiic.com/products/tu-gom-0805-100nf-0-1uf-50v; Supplier 1: Digikey; Supplier 1 Part Number: 1276-1007-1-ND; Supplier 1 Link: https://www.digikey.com/product-detail/en/samsung-electro-mechanics/CL21F104ZBCNNNC/1276-1007-1-ND/3889093
DOWN EXIT OK UP = 434113043826: as MRESET on sheet MCU_Main; ComponentLink1Description: Manufacturer; ComponentLink1URL: http://www.we-online.de; ComponentLink2Description: Datasheet; ComponentLink2URL: https://katalog.we-online.com/em/datasheet/434113043826.pdf; Operating Temperature: -40 to +85degC; Part Number: 434113043826; Published Date: September 2019; Contact Material: Stainless Steel; Height: 4.3mm; Mounting Technology: SMT; Contact Plating: Silver; Operation Force: 260gf; Packaging: Tape and Reel; Terminal Material: Copper Alloy; Publisher: Wurth Elektronik; Terminal Plating: Silver; Local Supplier: thegioiic; Local Supplier Link: https://www.thegioiic.com/products/nut-nhan-3-5x6mm-cao-5mm-2-chan-smd-dau-trang; Local Supplier Part Number: x
R14-R18 = Res-47K-0805: RES SMD 47K OHM 1% 1/8W 0805; Manufacturer: Yageo; Manufacturer Part Number: RC0805FR-0747KL; Local Supplier: thegioiic; Local Supplier Link: https://thegioiic.com/products/dien-tro-47k-ohm-0603-5; Supplier 1: Digikey; Supplier 1 Part Number: 311-47.0KCRCT-ND; Supplier 1 Link: https://www.digikey.com/product-detail/en/yageo/RC0805FR-0747KL/311-47.0KCRCT-ND/730920
R19-R22 = Res-10k-0805: as R7 on sheet MCU_Main; Local Supplier: thegioiic; Local Supplier Link: https://www.thegioiic.com/products/dien-tro-10-kohm-0805-5; Supplier 1: Digikey; Supplier 1 Link: https://www.digikey.com/product-detail/en/stackpole-electronics-inc/RNCP0805FTD10K0/RNCP0805FTD10K0CT-ND/2240601; Supplier 1 Part Number: RNCP0805FTD10K0CT-ND
U*1 = SD_Connect: 8 pin, PUSH-PUSH

## Sheet Motor.SchDoc
size A4; SheetNumber: 5; SheetTotal: 5
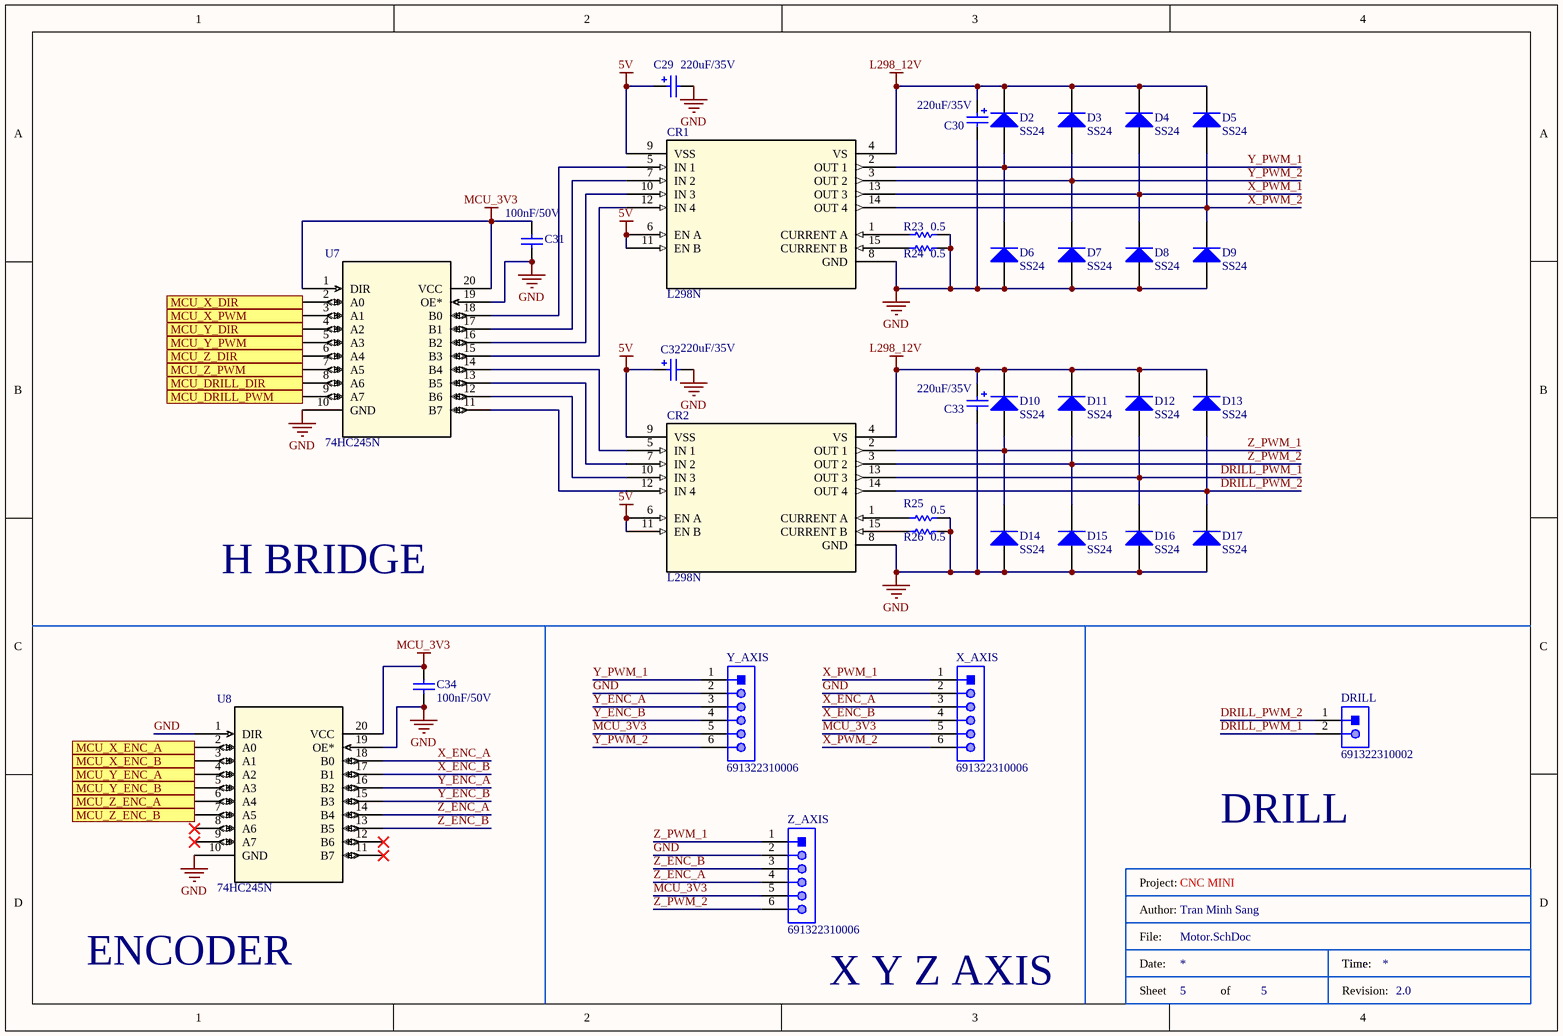
[diagram p4: Motor.SchDoc]

### Parts
(Parts that share a designator on the sheet are numbered #1, #2 ... from top to bottom, then left to right.)
*#5  Title Block  (value not drawn)  (graphical)
C29  value 220uF/35V  [CAP-SM-AL-SIZE-F-D8L10]  (hidden comment: Cap-Al-220uF-35V-D8L10)
C30  value 220uF/35V  [CAP-SM-AL-SIZE-F-D8L10]  (hidden comment: Cap-Al-220uF-35V-D8L10)
C31  value 100nF/50V  [CAP-SM-0805]  (hidden comment: Cap-100nF-50V-0805)
C32  value 220uF/35V  [CAP-SM-AL-SIZE-F-D8L10]  (hidden comment: Cap-Al-220uF-35V-D8L10)
C33  value 220uF/35V  [CAP-SM-AL-SIZE-F-D8L10]  (hidden comment: Cap-Al-220uF-35V-D8L10)
C34  value 100nF/50V  [CAP-SM-0805]  (hidden comment: Cap-100nF-50V-0805)
CR1  L298N  [Multiwatt15_V_STM]
CR2  L298N  [Multiwatt15_V_STM]
D2  SS24  [SS24]
D3  SS24  [SS24]
D4  SS24  [SS24]
D5  SS24  [SS24]
D6  SS24  [SS24]
D7  SS24  [SS24]
D8  SS24  [SS24]
D9  SS24  [SS24]
D10  SS24  [SS24]
D11  SS24  [SS24]
D12  SS24  [SS24]
D13  SS24  [SS24]
D14  SS24  [SS24]
D15  SS24  [SS24]
D16  SS24  [SS24]
D17  SS24  [SS24]
DRILL  691322310002  [691322310002]
R23  value 0.5  [RES-SM-0805]  (hidden comment: Res-0-0805)
R24  value 0.5  [RES-SM-0805]  (hidden comment: Res-0-0805)
R25  value 0.5  [RES-SM-0805]  (hidden comment: Res-0-0805)
R26  value 0.5  [RES-SM-0805]  (hidden comment: Res-0-0805)
U7  74HC245N  [74HC245N]
U8  74HC245N  [74HC245N]
X_AXIS  691322310006  [691322310006]
Y_AXIS  691322310006  [691322310006]
Z_AXIS  691322310006  [691322310006]

### Ports
MCU_DRILL_DIR (in), MCU_DRILL_PWM (in), MCU_X_DIR (in), MCU_X_ENC_A (out), MCU_X_ENC_B (out), MCU_X_PWM (in), MCU_Y_DIR (in), MCU_Y_ENC_A (out), MCU_Y_ENC_B (out), MCU_Y_PWM (in), MCU_Z_DIR (in), MCU_Z_ENC_A (out), MCU_Z_ENC_B (out), MCU_Z_PWM (in)

### Nets
5V: C29.1 C32.1 CR1.6(EN_A) CR1.9(VSS) CR1.11(EN_B) CR2.6(EN_A) CR2.9(VSS) CR2.11(EN_B)
GND: C29.2 C30.2 C31.1 C32.2 C33.2 C34.1 CR1.8(GND) CR2.8(GND) D6.2(A) D7.2(A) D8.2(A) D9.2(A) D14.2(A) D15.2(A) D16.2(A) D17.2(A) R23.1 R24.1 R25.1 R26.1 U7.10(GND) U7.19(OE*) U8.1(DIR) U8.10(GND) U8.19(OE*) X_AXIS.2 Y_AXIS.2 Z_AXIS.2
L298_12V: C30.1 C33.1 CR1.4(VS) CR2.4(VS) D2.1(K) D3.1(K) D4.1(K) D5.1(K) D10.1(K) D11.1(K) D12.1(K) D13.1(K)
MCU_3V3: C31.2 C34.2 U7.1(DIR) U7.20(VCC) U8.20(VCC) X_AXIS.5 Y_AXIS.5 Z_AXIS.5
DRILL_PWM_1: CR2.13(OUT_3) D12.2(A) D16.1(K) DRILL.2
DRILL_PWM_2: CR2.14(OUT_4) D13.2(A) D17.1(K) DRILL.1
X_ENC_A: U8.18(B0) X_AXIS.3
X_ENC_B: U8.17(B1) X_AXIS.4
X_PWM_1: CR1.13(OUT_3) D4.2(A) D8.1(K) X_AXIS.1
X_PWM_2: CR1.14(OUT_4) D5.2(A) D9.1(K) X_AXIS.6
Y_ENC_A: U8.16(B2) Y_AXIS.3
Y_ENC_B: U8.15(B3) Y_AXIS.4
Y_PWM_1: CR1.2(OUT_1) D2.2(A) D6.1(K) Y_AXIS.1
Y_PWM_2: CR1.3(OUT_2) D3.2(A) D7.1(K) Y_AXIS.6
Z_ENC_A: U8.14(B4) Z_AXIS.4
Z_ENC_B: U8.13(B5) Z_AXIS.3
Z_PWM_1: CR2.2(OUT_1) D10.2(A) D14.1(K) Z_AXIS.1
Z_PWM_2: CR2.3(OUT_2) D11.2(A) D15.1(K) Z_AXIS.6
NetCR1_1: CR1.1(CURRENT_A) R23.2
NetCR1_5: CR1.5(IN_1) U7.18(B0)
NetCR1_7: CR1.7(IN_2) U7.17(B1)
NetCR1_10: CR1.10(IN_3) U7.16(B2)
NetCR1_12: CR1.12(IN_4) U7.15(B3)
NetCR1_15: CR1.15(CURRENT_B) R24.2
NetCR2_1: CR2.1(CURRENT_A) R25.2
NetCR2_5: CR2.5(IN_1) U7.14(B4)
NetCR2_7: CR2.7(IN_2) U7.13(B5)
NetCR2_10: CR2.10(IN_3) U7.12(B6)
NetCR2_12: CR2.12(IN_4) U7.11(B7)
NetCR2_15: CR2.15(CURRENT_B) R26.2
NetU5_10: U8.4(A2) ; port MCU_Y_ENC_A
NetU5_11: U8.5(A3) ; port MCU_Y_ENC_B
NetU5_14: U7.8(A6) ; port MCU_DRILL_DIR
NetU5_15: U7.6(A4) ; port MCU_Z_DIR
NetU5_16: U7.9(A7) ; port MCU_DRILL_PWM
NetU5_17: U7.7(A5) ; port MCU_Z_PWM
NetU5_18: U7.5(A3) ; port MCU_Y_PWM
NetU5_19: U7.3(A1) ; port MCU_X_PWM
NetU5_29: U8.6(A4) ; port MCU_Z_ENC_A
NetU5_30: U8.7(A5) ; port MCU_Z_ENC_B
NetU5_42: U8.3(A1) ; port MCU_X_ENC_B
NetU5_43: U8.2(A0) ; port MCU_X_ENC_A
NetU5_45: U7.4(A2) ; port MCU_Y_DIR
NetU5_46: U7.2(A0) ; port MCU_X_DIR

Not connected (* = marked no-connect by the designer): U8 8(A6)* 9(A7)* 11(B7)* 12(B6)*

### Notes on the sheet
- H BRIDGE
- (near DRILL) DRILL
- ENCODER
- X Y Z AXIS
- (in symbol Title Block) Project:; Author:; File:; Date:; Time:; Sheet; of; Revision:

### Library data of the parts
C29 C30 C32 C33 = Cap-Al-220uF-35V-D8L10: CAP ALUM 220UF 20% 35V SMD; Manufacturer: Nichicon; Manufacturer Part Number: UWT1V221MNL1GS; Local Supplier: thegioiic; Local Supplier Link: https://thegioiic.com/products/tu-nhom-smd-220uf-35v-d8l10; Supplier 1: Digikey; Supplier 1 Link: https://www.digikey.com/product-detail/en/nichicon/UWT1V221MNL1GS/493-2205-2-ND/589946; Supplier 1 Part Number: 493-2205-2-ND
C31 C34 = Cap-100nF-50V-0805: as C8 on sheet MCU_Main; Local Supplier: thegioiic; Local Supplier Link: https://www.thegioiic.com/products/tu-gom-0805-100nf-0-1uf-50v; Supplier 1: Digikey; Supplier 1 Part Number: 1276-1007-1-ND; Supplier 1 Link: https://www.digikey.com/product-detail/en/samsung-electro-mechanics/CL21F104ZBCNNNC/1276-1007-1-ND/3889093
CR1 CR2 = L298N: No Description Available; Mfr_Name: STMicroelectronics; Type: DEV; Copyright: Copyright (C) 2023 Ultra Librarian. All rights reserved.; Manufacturer_Part_Number: L298N; RefDes: RefDes
D2-D17 = Diode-SS24: DIODE SCHOTTKY 40V 2A DO214AA; Manufacturer: ON Semiconductor; Local Supplier: thegioiic; Local Supplier Link: https://thegioiic.com/products/ss24-smb; Supplier 1: Digikey; Supplier 1 Part Number: SS24FSCT-ND; Manufacturer Part Number: SS24; Supplier 1 Link: https://www.digikey.com/product-detail/en/on-semiconductor/SS24/SS24FSCT-ND/1626273
DRILL = 691322310002: as HOME_X on sheet MCU_Control; ComponentLink1Description: Manufacturer; ComponentLink1URL: http://www.we-online.de; ComponentLink2URL: https://katalog.we-online.de/em/datasheet/691322310002.pdf; ComponentLink2Description: Datasheet; Mounting Technology: THT; Part Number: 691322310002; Packaging: Box; Operating Temperature: -40 to +105degC; PCB/Cable/Panel: PCB; Pitch: 3.81mm; Published Date: October 2019; Type: Horizontal; Publisher: Wurth Elektronik; Application: Pluggable
R23-R26 = Res-0-0805: RES 0 OHM JUMPER 0805; Manufacturer: Vishay Dale; Manufacturer Part Number: WSL080500000ZEA9; Local Supplier: thegioiic; Local Supplier Link: https://thegioiic.com/products/dien-tro-0-ohm-0805-5; Supplier 1: Digikey; Supplier 1 Link: https://www.digikey.com/product-detail/en/vishay-dale/WSL080500000ZEA9/541-3928-1-ND/7423223; Supplier 1 Part Number: 541-3928-1-ND
U7 U8 = 74HC245N: No Description Available; Mfr_Name: NXP; Copyright: Copyright (C) 2022 Ultra Librarian. All rights reserved.; Manufacturer_Part_Number: 74HC245N; RefDes: RefDes; Type: DEV
X_AXIS Y_AXIS Z_AXIS = 691322310006: WR-TBL Serie 322 Horizontal PCB Header, Pluggable, pitch 3.81mm, 6p; Compliance: RoHS; Modularity: No; Pin Number: 6; Rated Current [UL]: 10A; Working Voltage [UL]: 300VAC; ComponentLink1Description: Manufacturer; ComponentLink1URL: http://www.we-online.de; ComponentLink2URL: https://katalog.we-online.de/em/datasheet/691322310006.pdf; ComponentLink2Description: Datasheet; Mounting Technology: THT; Part Number: 691322310006; Packaging: Box; Operating Temperature: -40 to +105degC; PCB/Cable/Panel: PCB; Pitch: 3.81mm; Published Date: October 2019; Type: Horizontal; Publisher: Wurth Elektronik; Application: Pluggable

## Nets that join several sheets
5V: PowerSupply (5 pins), MCU_Main (B1.1), Motor (8 pins)
GND: PowerSupply (10 pins), MCU_Main (18 pins), MCU_Control (21 pins), Control_Display_SD (16 pins), Motor (28 pins)
L298_12V: PowerSupply (P2.2), Motor (12 pins)
MCU_3V3: PowerSupply (C5.1 U3.2 U3.4), MCU_Control (15 pins), Motor (8 pins)
MMCU_3V3: PowerSupply (C4.1 U2.2 U2.4), MCU_Main (13 pins), Control_Display_SD (R19.2 R20.2 R21.2 R22.2)
VDD: PowerSupply (U1.2 U1.4), Control_Display_SD (9 pins)
CMD: MCU_Main (U4.17), Control_Display_SD (R17.1 U*1.3)
CS: MCU_Main (U4.14), Control_Display_SD (R18.1 U*1.2)
DAT0: MCU_Main (U4.16), Control_Display_SD (R16.1 U*1.7)
NetC25_2: MCU_Main (U4.39), Control_Display_SD (C25.2 R19.1 UP.2)
NetC26_2: MCU_Main (U4.38), Control_Display_SD (C26.2 DOWN.2 R20.1)
NetC27_2: MCU_Main (U4.40), Control_Display_SD (C27.2 OK.2 R21.1)
NetC28_2: MCU_Main (U4.41), Control_Display_SD (C28.2 EXIT.2 R22.1)
NetU4_12: MCU_Main (U4.12), MCU_Control (U5.13)
NetU4_13: MCU_Main (U4.13), MCU_Control (U5.12)
NetU4_15: MCU_Main (U4.15), Control_Display_SD (U*1.5)
NetU4_42: MCU_Main (U4.42), Control_Display_SD (U6.3)
NetU4_43: MCU_Main (U4.43), Control_Display_SD (U6.4)
NetU5_10: MCU_Control (U5.10), Motor (U8.4)
NetU5_11: MCU_Control (U5.11), Motor (U8.5)
NetU5_14: MCU_Control (U5.14), Motor (U7.8)
NetU5_15: MCU_Control (U5.15), Motor (U7.6)
NetU5_16: MCU_Control (U5.16), Motor (U7.9)
NetU5_17: MCU_Control (U5.17), Motor (U7.7)
NetU5_18: MCU_Control (U5.18), Motor (U7.5)
NetU5_19: MCU_Control (U5.19), Motor (U7.3)
NetU5_29: MCU_Control (U5.29), Motor (U8.6)
NetU5_30: MCU_Control (U5.30), Motor (U8.7)
NetU5_42: MCU_Control (U5.42), Motor (U8.3)
NetU5_43: MCU_Control (U5.43), Motor (U8.2)
NetU5_45: MCU_Control (U5.45), Motor (U7.4)
NetU5_46: MCU_Control (U5.46), Motor (U7.2)